# EAGLE design dualstepper (EAGLE 6.2)
LICENCE: Copyright Alan Wood 2011. This documentation describes Open Hardware and is licensed under the CERN OHL v. 1.1. You may redistribute and modify this documentation under the terms of the CERN OHL v.1.1. (http://ohwr.org/cernohl). This documentation is distributed WITHOUT ANY EXPRESS OR IMPLIED WARRANTY, INCLUDING OF MERCHANTABILITY, SATISFACTORY QUALITY AND FITNESS FOR A PARTICULAR PURPOSE. Please see the CERN OHL v.1.1 for applicable conditions
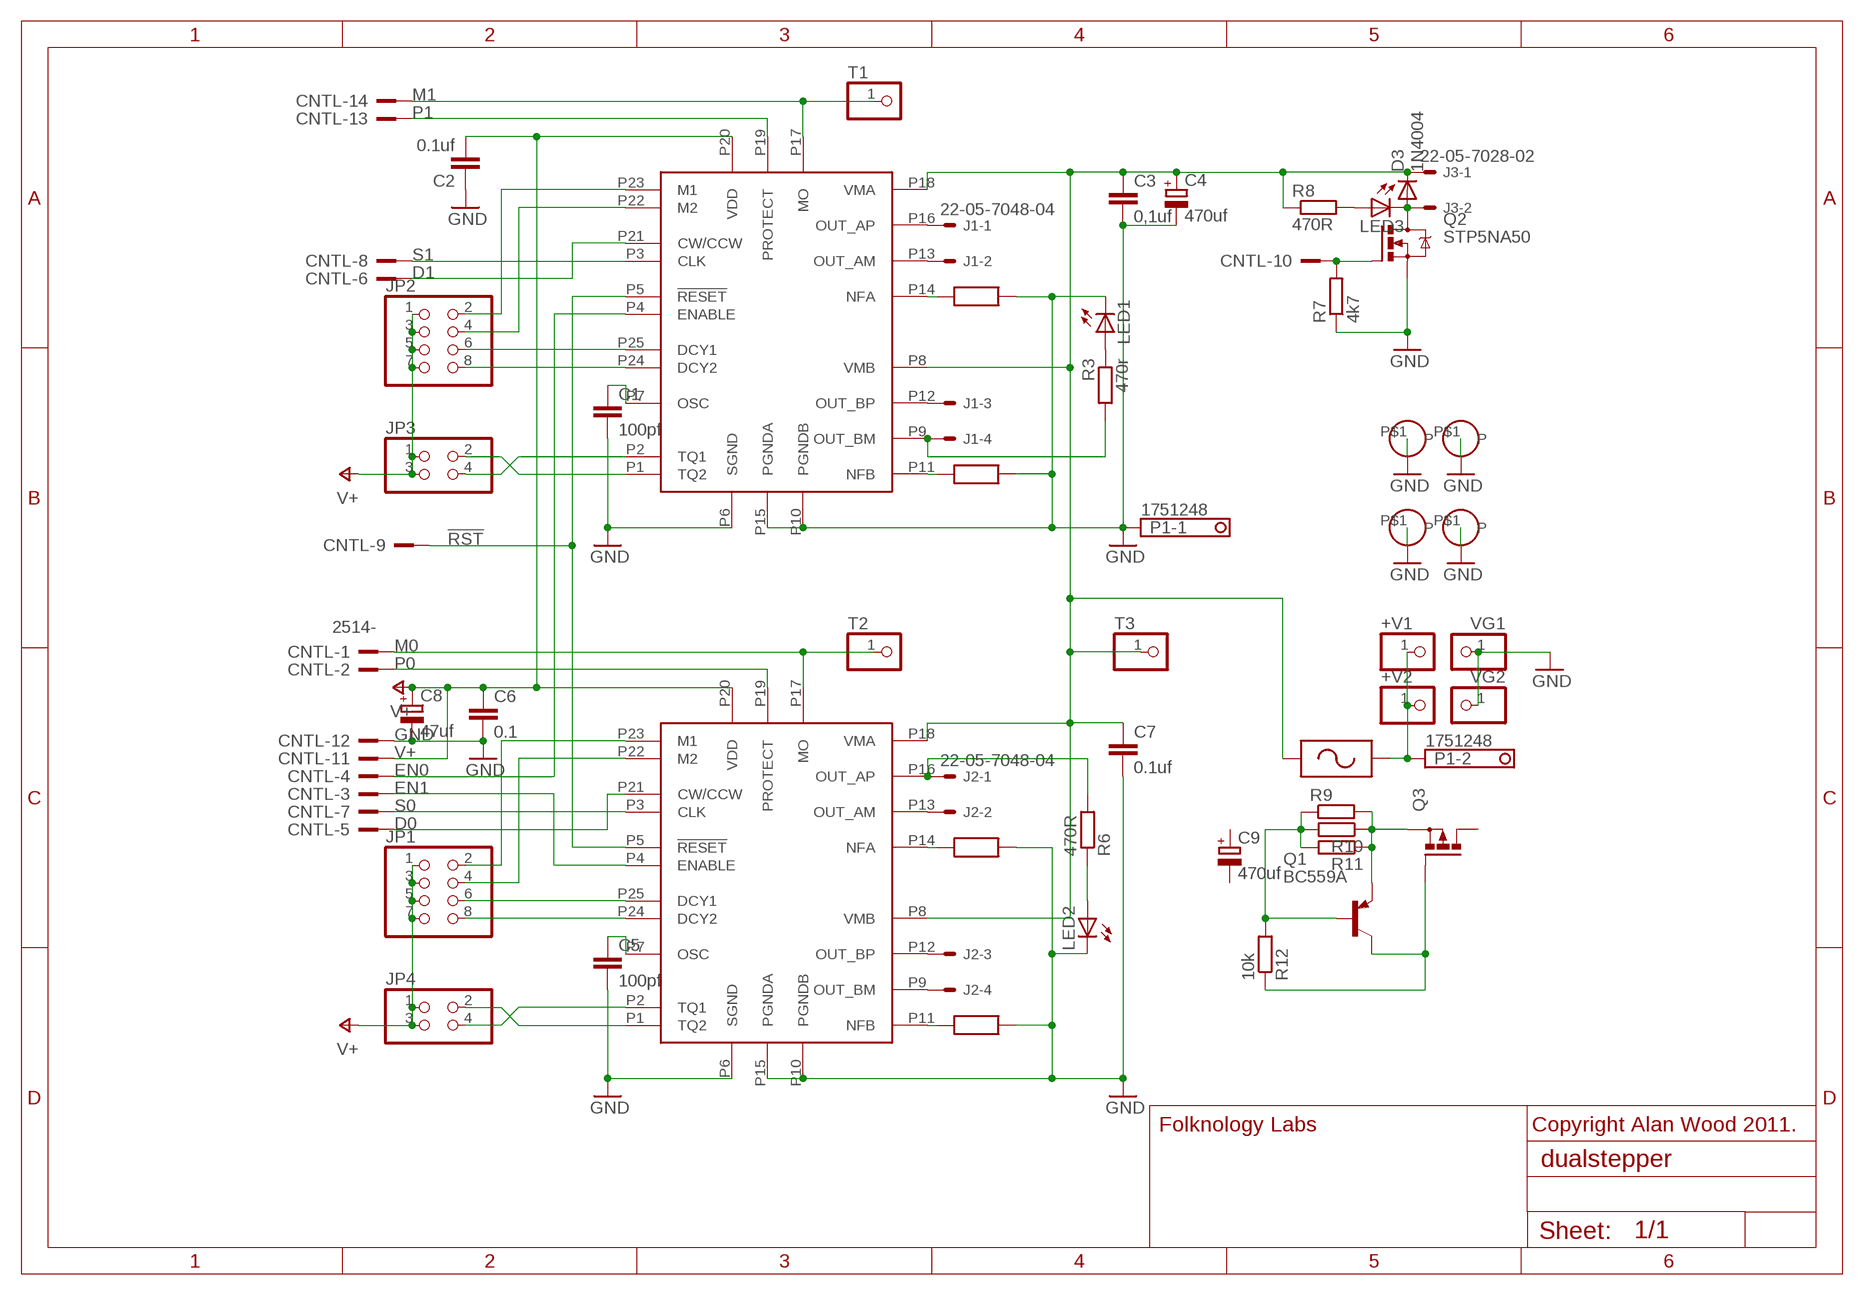
[diagram p0: schematic, sheet 1]

## Parts
+V1  PINHD-1X1  [1X01]
+V2  PINHD-1X1  [1X01]
C1  100pf  C-EU025-024X044  [C025-024X044]
C2  0.1uf  C-EU025-024X044  [C025-024X044]
C3  0,1uf  C-EU025-024X044  [C025-024X044]
C4  470uf  CPOL-EUE22-9AXIAL  [E22-9]
C5  100pf  C-EU025-024X044  [C025-024X044]
C6  0.1  C-EU025-024X044  [C025-024X044]
C7  0.1uf  C-EU025-024X044  [C025-024X044]
C8  47uf  CPOL-EUE1.8-4  [E1,8-4]
C9  470uf  CPOL-EUE3.5-8  [E3,5-8]
CNTL  2514-  [PAK100/2500-14]
D3  1N4004  DIODE-D-7.5  [D-7.5]
J1  22-05-7048-04  [7395-04]
J2  22-05-7048-04  [7395-04]
J3  22-05-7028-02  [7395-02]
JP1  PINHD-2X4  [2X04]
JP2  PINHD-2X4  [2X04]
JP3  PINHD-2X2  [2X02]
JP4  PINHD-2X2  [2X02]
LED1  LED3MM  [LED3MM]
LED2  LED3MM  [LED3MM]
LED3  LED3MM  [LED3MM]
P1  1751248  [1751248]
Q1  BC559A  [TO92-EBC]
Q2  STP5NA50  [TO220BV]
Q3  PMOSFET_PTO220BV  [TO220BV]
R1  R22  3W-WIREWOUND-RESISTOR  [R20]
R2  R22  3W-WIREWOUND-RESISTOR  [R20]
R3  470r  R-EU_0204/7  [0204/7]
R4  R22  3W-WIREWOUND-RESISTOR  [R20]
R5  R22  3W-WIREWOUND-RESISTOR  [R20]
R6  470R  R-EU_0204/7  [0204/7]
R7  4k7  R-EU_0204/7  [0204/7]
R8  470R  R-EU_0204/7  [0204/7]
R9  R-EU_0411/3V  [0411V]
R10  R-EU_0411/3V  [0411V]
R11  R-EU_0411/3V  [0411V]
R12  10k  R-EU_0204/7  [0204/7]
T1  PINHD-1X1  [1X01]
T2  PINHD-1X1  [1X01]
T3  PINHD-1X1  [1X01]
U$1  TB6560AHQ  [HZIP25-P-1.27]
U$2  TB6560AHQ  [HZIP25-P-1.27]
U$3  HOLE  [HOLE]
U$4  HOLE  [HOLE]
U$5  HOLE  [HOLE]
U$6  HOLE  [HOLE]
U$7  RXEFXXX-RAYCHEM-POLYSWITCH10.2  [2*10.2]
VG1  PINHD-1X1  [1X01]
VG2  PINHD-1X1  [1X01]

## Nets
!RST: CNTL.9 U$1.P5(!RESET) U$2.P5(!RESET)
D0: CNTL.5 U$1.P21(CW/CCW)
D1: CNTL.6 U$2.P21(CW/CCW)
EN0: CNTL.4 U$2.P4(ENABLE)
EN1: CNTL.3 U$1.P4(ENABLE)
GND: C1.2 C2.1 C3.2 C4.- C5.2 C6.2 C7.2 C8.- CNTL.12 LED1.K(C) LED2.K(C) P1.1 Q2.S R1.P$2 R2.P$2 R4.P$2 R5.P$2 R7.1 U$1.P6(SGND) U$1.P10(PGNDB) U$1.P15(PGNDA) U$2.P6(SGND) U$2.P10(PGNDB) U$2.P15(PGNDA) U$3.P$1(P) U$4.P$1(P) U$5.P$1(P) U$6.P$1(P) VG1.1 VG2.1
M0: CNTL.1 T2.1 U$1.P17(MO)
M1: CNTL.14 T1.1 U$2.P17(MO)
N$1: +V1.1 +V2.1 P1.2 U$7.P$2
N$2: J1.2 U$2.P13(OUT_AM)
N$3: J1.3 U$2.P12(OUT_BP)
N$4: J1.4 R3.2 U$2.P9(OUT_BM)
N$5: C1.1 U$2.P7(OSC)
N$6: JP2.2 U$2.P23(M1)
N$7: J2.2 U$1.P13(OUT_AM)
N$8: LED2.A R6.1
N$9: LED1.A R3.1
N$10: J2.3 U$1.P12(OUT_BP)
N$11: JP3.2 U$2.P1(TQ2)
N$12: JP3.4 U$2.P2(TQ1)
N$13: D3.A J3.2 LED3.K(C) Q2.D
N$14: J2.4 U$1.P9(OUT_BM)
N$15: J1.1 U$2.P16(OUT_AP)
N$16: Q1.B R9.1 R10.2 R11.2 R12.2
N$17: JP2.8 U$2.P24(DCY2)
N$18: JP2.6 U$2.P25(DCY1)
N$19: JP2.4 U$2.P22(M2)
N$20: Q1.E Q3.S R9.2 R10.1 R11.1
N$21: J2.1 R6.2 U$1.P16(OUT_AP)
N$22: Q1.C Q3.G R12.1
N$25: JP4.4 U$1.P2(TQ1)
N$26: JP4.2 U$1.P1(TQ2)
N$27: JP1.8 U$1.P24(DCY2)
N$29: JP1.6 U$1.P25(DCY1)
N$30: R2.P$1 U$2.P11(NFB)
N$31: JP1.4 U$1.P22(M2)
N$33: R1.P$1 U$2.P14(NFA)
N$34: R5.P$1 U$1.P11(NFB)
N$35: R4.P$1 U$1.P14(NFA)
N$36: C5.1 U$1.P7(OSC)
N$37: JP1.2 U$1.P23(M1)
N$50: CNTL.10 Q2.G R7.2
N$52: LED3.A R8.2
P0: CNTL.2 U$1.P19(PROTECT)
P1: CNTL.13 U$2.P19(PROTECT)
S0: CNTL.7 U$1.P3(CLK)
S1: CNTL.8 U$2.P3(CLK)
V+: C2.2 C6.1 C8.+ CNTL.11 JP1.1 JP1.3 JP1.5 JP1.7 JP2.1 JP2.3 JP2.5 JP2.7 JP3.1 JP3.3 JP4.1 JP4.3 U$1.P20(VDD) U$2.P20(VDD)
VM: C3.1 C4.+ C7.1 D3.C J3.1 R8.1 T3.1 U$1.P8(VMB) U$1.P18(VMA) U$2.P8(VMB) U$2.P18(VMA) U$7.P$1
Unconnected: C9.+ C9.- Q3.D

## Notes on the sheet
- Folknology Labs | Copyright Alan Wood 2011.

## Library data of the parts
+V1 +V2 T1-T3 VG1 VG2 = pinhead:PINHD-1X1: PIN HEADER; MF: MOLEX; MPN: 90120-0761; OC_FARNELL: 1756963
C1 C5 = resistor:C-EU: CAPACITOR, European symbol; MF: AVX; MPN: SR151A101JAR; OC_FARNELL: 1100372
C2 C3 C6 C7 = resistor:C-EU: CAPACITOR, European symbol; MF: VISHAY; MPN: K104K15X7RF53L2; OC_FARNELL: 1141775
C4 C9 = rcl:CPOL-EU: POLARIZED CAPACITOR, European symbol; MF: MULTICOMP; MPN: MCTEA471M1EB-1021P; OC_FARNELL: 1832427
C8 = rcl:CPOL-EU: POLARIZED CAPACITOR, European symbol; MF: RUBYCON; MPN: 16YXF47MEFC5X11; OC_FARNELL: 1144612
CNTL = con-3m:2514-: 3M (TM) Pak 100 4-Wall Header Source: 3M; MF: HARTING; MPN: 09 18 510 7323; OC_FARNELL: 1096980; OC_NEWARK: unknown
D3 = diode:DIODE-: DIODE; MF: ON SEMICONDUCTOR; MPN: 1N4004RL; OC_FARNELL: 9556109
J1 J2 = con-molex:22-?-04: CONNECTOR wire to board 2.54 mm (.1 inch) pitch header; MF: MOLEX; MPN: 22-05-7048; OC_FARNELL: 9731628; OC_NEWARK: unknown
J3 = con-molex:22-?-02: CONNECTOR wire to board 2.54 mm (.1 inch) pitch header; MF: MOLEX; MPN: 22-05-7028; OC_FARNELL: 9731601; OC_NEWARK: unknown
JP1 JP2 = pinhead:PINHD-2X4: PIN HEADER; MF: HARWIN; MPN: M20-9980446; OC_FARNELL: 1022233
JP3 JP4 = pinhead:PINHD-2X2: PIN HEADER; MF: SAMTEC; MPN: TSW-101-07-T-D; OC_FARNELL: 2025407
LED1-LED3 = led:LED: LED OSRAM: - CHIPLED LG R971, LG N971, LY N971, LG Q971, LY Q971, LO R971, LY R971 LH N974, LH R974 LS Q976, LO Q976, LY Q976 LO Q996 - Hyper CHIPLED LW Q18S LB Q993, LB Q99A, LB R99A - SideLED LS A670, LO A670, LY A670, LG A670, LP A670 LB A673, LV A673, LT A673, LW A673 LH A674 LY A675 LS A676, LA A676, LO A676, LY A676, LW A676 LS A679, LY A679, LG A679 - Hyper Micro SIDELED® LS Y876, LA Y876, LO Y876, LY Y876 LT Y87S - SmartLED LW L88C, LW L88S LB L89C, LB L89S, LG L890 LS L89K, LO L89K, LY L89K LS L896, LA L896, LO L896, LY L896 - TOPLED LS T670, LO T670, LY T670, LG T670, LP T670 LSG T670, LSP T670, LSY T670, LOP T670, LYG T670 LG T671, LOG T671, LSG T671 LB T673, LV T673, LT T673, LW T673 LH T674 LS T676, LA T676, LO T676, LY T676, LB T676, LH T676, LSB T676, LW T676 LB T67C, LV T67C, LT T67C, LS T67K, LO T67K, LY T67K, LW E67C LS E67B, LA E67B, LO E67B, LY E67B, LB E67C, LV E67C, LT E67C LW T67C LS T679, LY T679, LG T679 LS T770, LO T770, LY T770, LG T770, LP T770 LB T773, LV T773, LT T773, LW T773 LH T774 LS E675, LA E675, LY E675, LS T675 LS T776, LA T776, LO T776, LY T776, LB T776 LHGB T686 LT T68C, LB T68C - Hyper Mini TOPLED® LB M676 - Mini TOPLED Santana® LG M470 LS M47K, LO M47K, LY M47K Source: http://www.osram.convergy.de LUXEON: - LUMILED® LXK2-PW12-R00, LXK2-PW12-S00, LXK2-PW14-U00, LXK2-PW14-V00 LXK2-PM12-R00, LXK2-PM12-S00, LXK2-PM14-U00 LXK2-PE12-Q00, LXK2-PE12-R00, LXK2-PE12-S00, LXK2-PE14-T00, LXK2-PE14-U00 LXK2-PB12-K00, LXK2-PB12-L00, LXK2-PB12-M00, LXK2-PB14-N00, LXK2-PB14-P00, LXK2-PB14-Q00 LXK2-PR12-L00, LXK2-PR12-M00, LXK2-PR14-Q00, LXK2-PR14-R00 LXK2-PD12-Q00, LXK2-PD12-R00, LXK2-PD12-S00 LXK2-PH12-R00, LXK2-PH12-S00 LXK2-PL12-P00, LXK2-PL12-Q00, LXK2-PL12-R00 Source: www.luxeon.com KINGBRIGHT: KA-3528ASYC Source: www.kingbright.com; MF: KINGBRIGHT; MPN: L-93WEYW; OC_FARNELL: 1142521
P1 = con-phoenix-350:1751248: MKDS 1/ 2-3,5 Printklemme Nennstrom: 10 A Bemessungsspannung: 160 V Raster: 3,5 mm Polzahl: 2 Montageart: Löten Anschlussart: Schraubanschluss Anschlussrichtung vom Leiter zur Platine: 0° Source: http://eshop.phoenixcontact.com .. 1751248.pdf; MF: CAMDEN; MPN: CTB3051/2; OC_FARNELL: 3882615; OC_NEWARK: unknown
Q1 = transistor-pnp:BC559*: PNP Transistror
Q2 = transistor-power:STP5NA50: N-CHANNEL MOS FET; MF: STMICROELECTRONICS; MPN: STP55NF06L.; OC_FARNELL: 1783902
Q3 = transistor-power:PMOSFET_P: Power MOSFET P-Channel
R1 R2 R4 R5 = gen:3W-WIREWOUND-RESISTOR; MF: WELWYN; MPN: WP4S-R22JA2; OC_FARNELL: 1219242
R3 R6 R12 = rcl:R-EU_: RESISTOR, European symbol; MF: WELWYN; MPN: MFR4 470R 1%; OC_FARNELL: 1099883
R7 = resistor:R-EU_: RESISTOR, European symbol; MF: WELWYN; MPN: MFR4 10K 1%; OC_FARNELL: 1099988
R8 = resistor:R-EU_: RESISTOR, European symbol; MF: WELWYN; MPN: MFR4 470R 1%; OC_FARNELL: 1099883
R9-R11 = resistor:R-EU_: RESISTOR, European symbol
U$1 U$2 = gen:TB6560AHQ; OC_FARNELL: unknown
U$3-U$6 = amino:HOLE; OC_FARNELL: unknown
U$7 = gen:RXEFXXX-RAYCHEM-POLYSWITCH; MF: TE CONNECTIVITY / RAYCHEM; MPN: AGRF1000; OC_FARNELL: 1345899

## Board
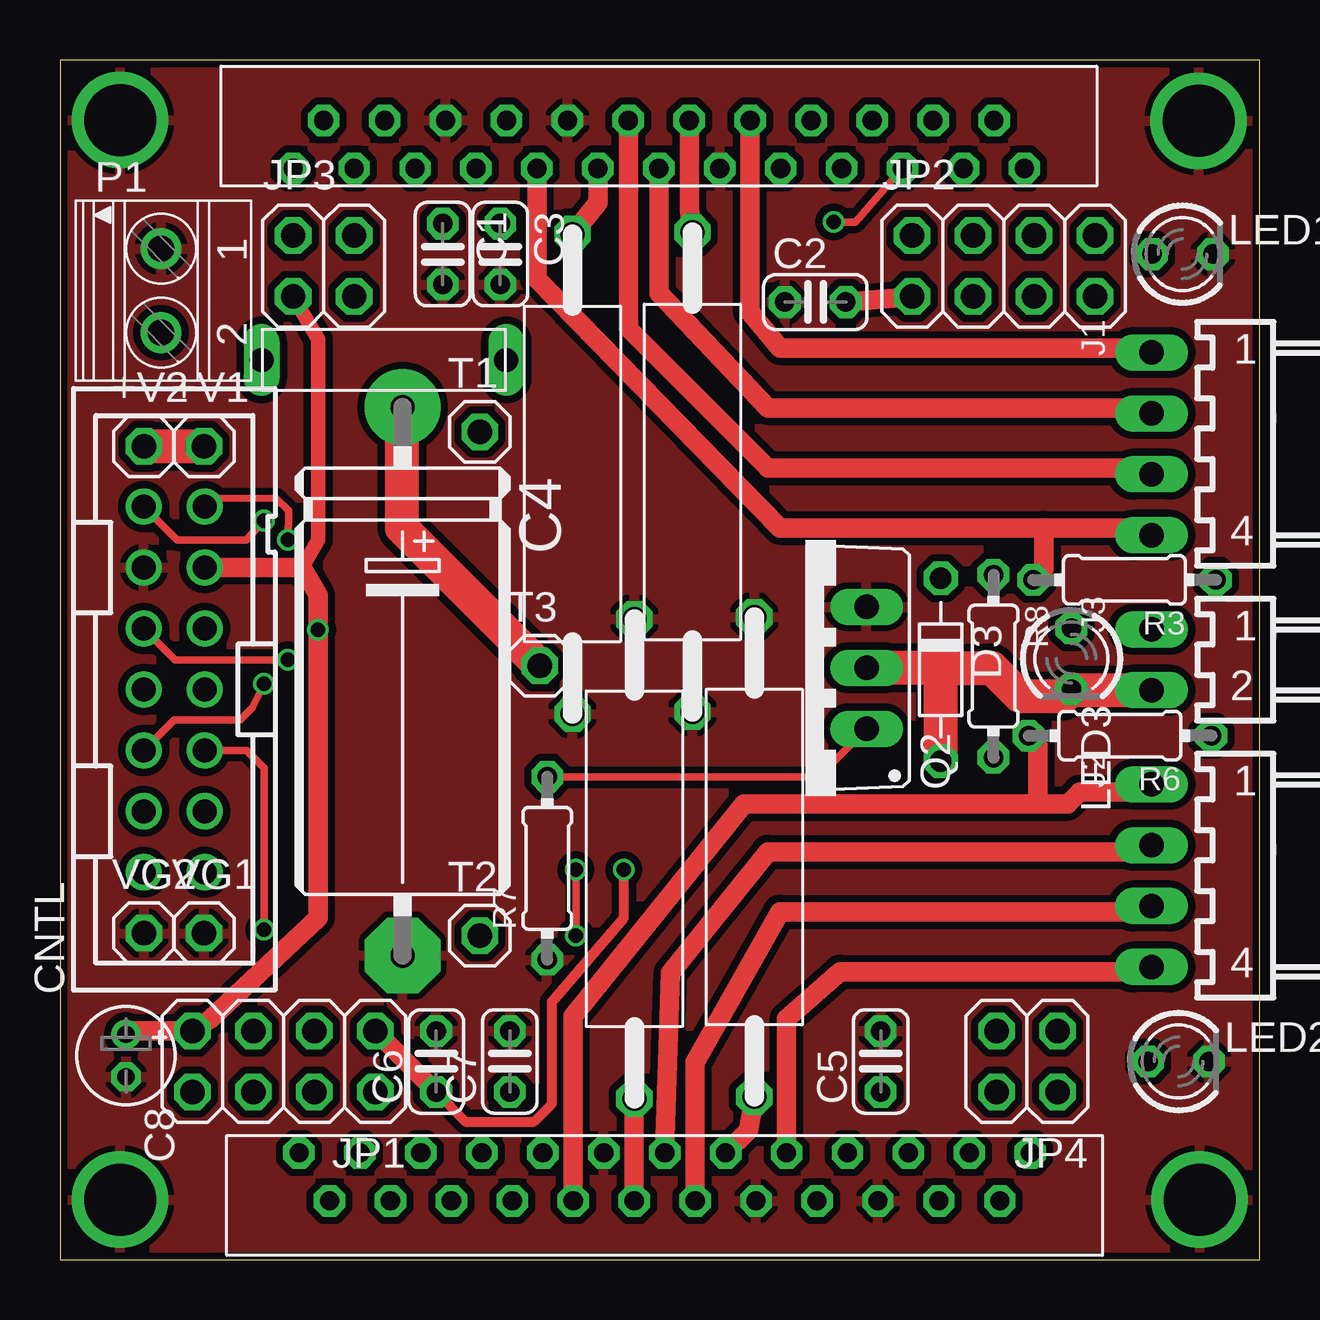
[diagram p1: board, top side]
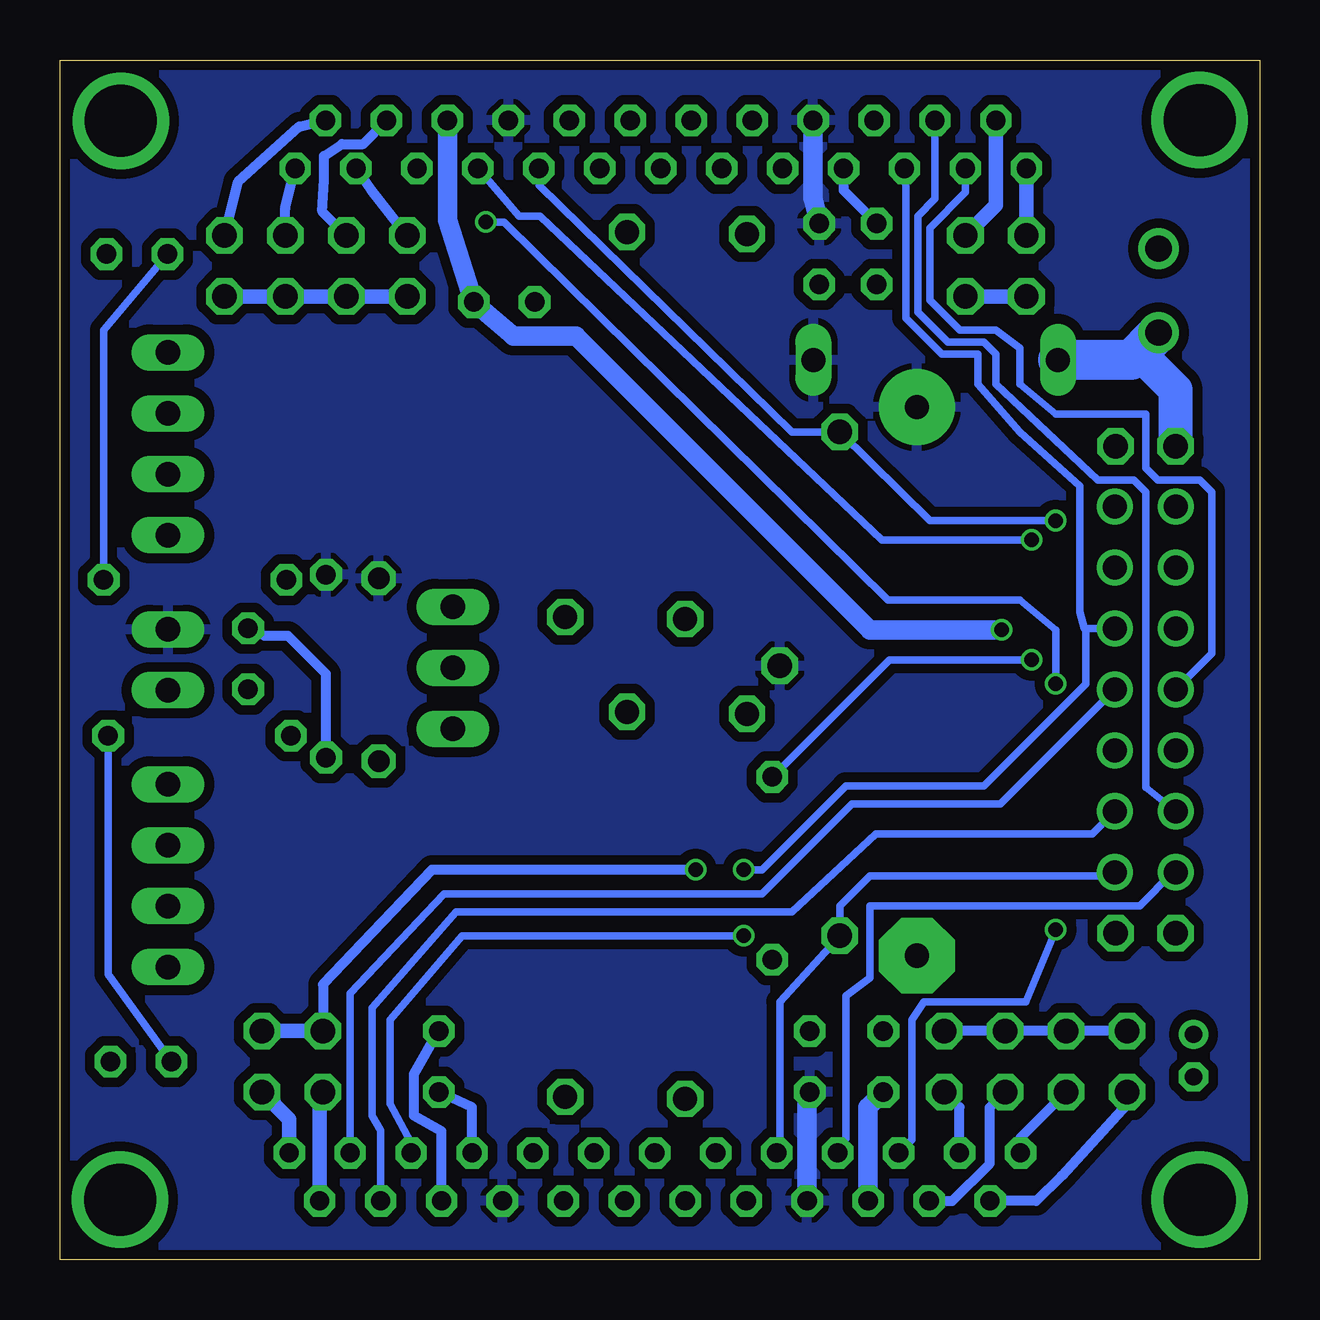
[diagram p2: board, bottom side, seen from below]

Size 50 x 50 mm. Coordinates in mm from the lower left corner, seen from the top.
Outline: 0,0 50,0 50,50 0,50 0,0
Copper layers (1*16): Top 0.035mm / dielectric 1.5mm / Bottom 0.035mm
Design rules: minimum track width 6mil, minimum drill 12mil, track to track 6mil, track to pad 6mil, pad to pad 6mil, via to via 6mil, smd to smd 0mil, copper to edge 10mil, drill to drill 10mil, minimum pad ring 10mil, minimum via ring 6mil, stop-mask expansion 2mil, vias tented up to drill 100mil, thermal gap 10mil

### Footprints (pad centres in the part's own frame; a part is rotated, then mirrored left to right if it is on the bottom)
1X01 = drill 1.016 octagon: 1 0,0
C025-024X044 = drill 0.813 octagon: 1 -1.27,0; 2 1.27,0
E22-9 = drill 1.016 pad 3.15: + -11.43,0 | drill 1.016 pad 3.15 octagon: - 11.43,0
E1,8-4 = drill 0.711 pad 1.168: + -0.889,0 | drill 0.711 pad 1.168 octagon: - 0.889,0
E3,5-8 = drill 0.813 pad 1.6: + -1.778,0 | drill 0.813 pad 1.6 octagon: - 1.778,0
PAK100/2500-14 = drill 1 pad 1.422: 1 -7.62,-1.27; 2 -7.62,1.27; 3 -5.08,-1.27; 4 -5.08,1.27; 5 -2.54,-1.27; 6 -2.54,1.27; 7 0,-1.27; 8 0,1.27; 9 2.54,-1.27; 10 2.54,1.27; 11 5.08,-1.27; 12 5.08,1.27; 13 7.62,-1.27; 14 7.62,1.27
D-7.5 = drill 0.9 octagon: A 3.81,0; C -3.81,0
7395-04 = drill 1.016 long: 1 3.81,0; 2 1.27,0; 3 -1.27,0; 4 -3.81,0
7395-02 = drill 1.016 long: 1 1.27,0; 2 -1.27,0
2X04 = drill 1.016 octagon: 1 -3.81,-1.27; 2 -3.81,1.27; 3 -1.27,-1.27; 4 -1.27,1.27; 5 1.27,-1.27; 6 1.27,1.27; 7 3.81,-1.27; 8 3.81,1.27
2X02 = drill 1.016 octagon: 1 -1.27,-1.27; 2 -1.27,1.27; 3 1.27,-1.27; 4 1.27,1.27
LED3MM = drill 0.813 octagon: A -1.27,0; K 1.27,0
1751248 = drill 1.1 pad 1.7: 1 -1.75,-0.1; 2 1.75,-0.1
TO92-EBC = drill 0.813 long: B 0,-1.27; C -2.54,-1.27; E 2.54,-1.27
TO220BV = drill 1.016 long: D 0,-2.54; G -2.54,-2.54; S 2.54,-2.54
R20 = drill 1 octagon: P$1 -10,0; P$2 10,0
0204/7 = drill 0.813 octagon: 1 -3.81,0; 2 3.81,0
0411V = drill 0.914 octagon: 1 -2.54,0; 2 1.27,0
HZIP25-P-1.27 = drill 0.8 octagon: P1 -15.24,-1.27; P2 -13.97,0.73; P3 -12.7,-1.27; P4 -11.43,0.73; P5 -10.16,-1.27; P6 -8.89,0.73; P7 -7.62,-1.27; P8 -6.35,0.73; P9 -5.08,-1.27; P10 -3.81,0.73; P11 -2.54,-1.27; P12 -1.27,0.73; P13 0,-1.27; P14 1.27,0.73; P15 2.54,-1.27; P16 3.81,0.73; P17 5.08,-1.27; P18 6.35,0.73; P19 7.62,-1.27; P20 8.89,0.73; P21 10.16,-1.27; P22 11.43,0.73; P23 12.7,-1.27; P24 13.97,0.73; P25 15.24,-1.27
HOLE = drill 3: P$1 0,0
2*10.2 = drill 1 long: P$1 -5.1,0; P$2 5.1,0

### Placement (x,y rotation side)
+V1  6,33.9 0 top
+V2  3.5,33.9 0 top
C1  15.96,41.91 270 top
C2  31.48,39.91 0 top
C3  18.35,41.91 270 top
C4  14.28,24.1 270 top
C5  34.21,8.26 90 top
C6  15.68,8.26 90 top
C7  18.75,8.26 90 top
C8  2.75,8.5 270 top
C9  69.25,24.5 180 top  (outside the outline)
CNTL  4.76,23.77 90 top
D3  36.72,24.59 270 top
J1  45.5,34 90 top
J2  45.5,16 90 top
J3  45.5,25 90 top
JP1  9.33,8.26 180 top
JP2  39.34,41.41 0 top
JP3  10.99,41.41 0 top
JP4  40.31,8.26 180 top
LED1  46.79,41.91 0 top
LED2  46.62,8.26 0 top
LED3  42.16,25.05 270 top
P1  4.31,40.38 270 top
Q1  67.5,35.5 180 top  (outside the outline)
Q2  31.08,24.66 90 top
Q3  69,29.25 180 top  (outside the outline)
R1  26.36,32.83 270 top
R2  21.36,32.75 270 top
R3  44.37,28.33 180 top
R4  23.94,16.7 90 top
R5  28.94,16.78 90 top
R6  44.18,21.84 180 top
R7  20.31,16.3 90 top
R8  38.91,24.73 270 top
R9  66.5,43.5 180 top  (outside the outline)
R10  68.5,46.25 0 top  (outside the outline)
R11  68.5,40.5 0 top  (outside the outline)
R12  72.5,43.25 90 top  (outside the outline)
T1  17.5,34.5 0 top
T2  17.5,13.5 0 top
T3  20,24.75 0 top
U$1  25.2,3.17 180 top
U$2  24.96,46.75 0 top
U$3  2.5,47.5 0 top
U$4  2.5,2.5 0 top
U$5  47.5,2.5 0 top
U$6  47.46,47.46 0 top
U$7  13.5,37.5 180 top
VG1  6,13.6 0 top
VG2  3.5,13.6 0 top

### Tracks (layer width: path | path; a pad name or v marks a point on that pad's centre or on a via)
!RST  (via drill 0.6)
  Top 0.305: v21.5,16.25 v21.5,13.5
  Bottom 0.305: U$2.P5 14.75,44.67 14.75,39.25 13.25,37.75 11.75,37.75 11.75,36.5 10,34.5 7.5,32.25 7.5,27 7.3,26.3 7.25,26.3 | 7.25,26.3 CNTL.9 | U$1.P5 35.37,4.87 36.25,6.5 36.25,10 33.25,13.5 v21.5,13.5 | v21.5,16.25 20.75,16.25 17.25,19.75 11.5,19.75 7.25,24 7.25,26.3
D0  (via drill 0.6)
  Top 0.305: v8.5,13.75 8.5,20.5 7.78,21.23 CNTL.5
  Bottom 0.305: U$1.P21 14.5,4.99 14.5,10 14,10.75 9.75,10.75 v8.5,13.75
D1  (via drill 0.6)
  Top 0.305: U$2.P21 33.15,43.25 v32.25,43.25 | v8.5,24 8,23 7.5,22.5 4.77,22.5 CNTL.6
  Bottom 0.305: v32.25,43.25 31.5,43.25 15.5,27.5 10,27.5 8.5,26.25 v8.5,24
EN0
  Bottom 0.305: U$2.P4 13.53,44.22 14.25,43.5 14.25,39.5 13,38.25 11.5,38.25 11,37.75 11,36.5 6.75,32.5 5.25,32.5 4.75,32 4.75,19.68 CNTL.4
EN1
  Bottom 0.305: U$1.P4 36.63,5.38 37,6 37,10.5 33.5,14.5 19.5,14.5 16,17.75 6.97,17.75 CNTL.3
GND
  Bottom 0.406: C5.2 35.25,7.74 35.25,6 34.09,5.34 U$1.P6
  pour Top (isolate 0.305): 0,50 50,50 50,0 0,0
M0
  Bottom 0.305: U$1.P17 20,4.57 20,10.75 T2.1 17.5,14.75 16.25,16 6.18,16 CNTL.1
M1  (via drill 0.6)
  Top 0.305: v8.5,30.8 7.75,30 4.88,30 CNTL.14
  Bottom 0.305: U$2.P17 30.04,44.79 19.5,34.5 T1.1 13.75,30.8 v8.5,30.8
N$1
  Top 1.422: +V2.1 +V1.1
  Bottom 1.422: 5.34,37.5 4.75,37.5 3.5,36.25 +V2.1
  Bottom 1.676: P1.2 5.34,37.5 U$7.P$2
N$2
  Top 0.813: U$2.P13 24.96,40.29 29.5,35.5 45.27,35.5 J1.2
N$3
  Top 0.813: U$2.P12 23.69,38.81 29.5,33 45.23,33 J1.3
N$4
  Top 0.813: U$2.P9 19.88,40.87 30,30.5 41,30.5 | 41,30.5 45.19,30.5 J1.4 | R3.2 41,28.77 41,30.5
N$5
  Bottom 0.406: U$2.P7 17.34,44.56 C1.1
N$6
  Bottom 0.406: U$2.P23 37.02,44.59 JP2.2
N$7
  Top 0.813: U$1.P13 25.45,11.96 29.5,17 45.23,17 J2.2
N$8
  Bottom 0.305: R6.1 47.99,11.89 LED2.A
N$9
  Bottom 0.305: R3.1 48.18,38.75 LED1.A
N$10
  Top 0.813: U$1.P12 26.48,8.22 30,14.5 45.27,14.5 J2.3
N$11
  Bottom 0.61: JP3.2 U$2.P1
N$12
  Bottom 0.61: U$2.P2 10.99,43.95 JP3.4
N$13
  Top 1.422: 36.5,24.66 Q2.D | 36.5,24.66 38.84,24.66 40,23.5 41.88,23.5 LED3.K 42.2,23.73 J3.2 | D3.A 36.72,24.45 36.5,24.66
N$14
  Top 0.813: U$1.P9 30.29,10.04 32.5,12 45.31,12 J2.4
N$15
  Top 0.813: U$2.P16 28.77,39.48 30,38 45.31,38 J1.1
N$16  (4 unrouted)
N$17
  Bottom 0.406: U$2.P24 40.03,47.22 42.57,44.93 JP2.8
N$18
  Bottom 0.406: U$2.P25 40.6,43.81 JP2.6
N$19
  Bottom 0.406: U$2.P22 37.36,46.5 38.25,46.5 39,46 39,45 39.06,43.69 JP2.4
N$20  (4 unrouted)
N$21
  Top 0.813: U$1.P16 21.39,10.14 28.5,19 40.75,19 | 40.75,19 42,19 42.5,19.5 45.19,19.5 J2.1 | R6.2 40.75,21.45 40.75,19
N$22  (2 unrouted)
N$25
  Bottom 0.61: U$1.P2 39.17,6.85 JP4.4
N$26
  Bottom 0.61: U$1.P1 40.45,5.85 JP4.2
N$27
  Bottom 0.406: U$1.P24 9.3,2.44 8.25,3.5 5.5,6.5 JP1.8
N$29
  Bottom 0.406: U$1.P25 9.96,5.08 JP1.6
N$30
  Top 0.813: U$2.P11 22.42,44.06 R2.P$1
N$31
  Bottom 0.406: U$1.P22 12.8,2.44 11.25,4 11.25,6.33 JP1.4
N$33
  Top 0.813: U$2.P14 26.23,43.71 R1.P$1
N$34
  Top 0.813: U$1.P11 28.69,5.39 R5.P$1
N$35
  Top 0.813: U$1.P14 23.93,6.46 R4.P$1
N$36
  Bottom 0.406: U$1.P7 32.83,6.35 C5.1
N$37
  Bottom 0.406: U$1.P23 12.51,6.35 JP1.2
N$50  (via drill 0.6)
  Top 0.305: Q2.G 31.61,20.11 R7.2 | v9.5,25 4.8,25 CNTL.10
  Bottom 0.305: R7.2 15.43,25 v9.5,25
N$52
  Bottom 0.406: R8.2 38.91,24.41 40.5,26 41.48,26 LED3.A
P0
  Bottom 0.305: U$1.P19 17.25,5.03 17.25,11 16.25,11.75 16.25,14.75 5,14.75 3.6,16.14 CNTL.2
P1  (via drill 0.6)
  Top 0.305: v9.5,30 9.54,31.21 9,31.71 6.5,31.75 CNTL.13
  Bottom 0.305: U$2.P19 30.86,43.5 30,43.5 15.75,30 v9.5,30
S0
  Bottom 0.305: U$1.P3 37.91,11.1 34,15.25 20.75,15.25 17,19 10.8,19 CNTL.7
S1
  Bottom 0.305: U$2.P3 12.26,44.49 13.75,43 13.75,40 12.5,38.75 11,38.75 10,38 10,36.5 8.5,35.25 4.75,35.25 4.75,33.25 4.75,33 4.25,32.5 2.5,32.5 2,32 2,25.26 CNTL.8
V+  (via drill 0.6)
  Top 0.406: v23.5,16.25 23.5,14.25 20.5,10.75 20.5,6.5 19.75,5.75 16.91,5.75 C6.1
  Top 0.61: JP3.1 10.75,38.36 10.75,30 10.1,28.84
  Top 0.813: JP1.1 C6.1 | C2.2 JP2.1 | CNTL.11 10.1,28.84 10.75,27.69 v10.75,26.25 10.75,14.25 6.28,10.03 JP1.7 2.89,9.53 C8.+
  Bottom 0.406: JP1.7 JP1.5 JP1.3 JP1.1 | JP4.3 39.04,11.46 34.5,16.25 v23.5,16.25
  Bottom 0.61: JP4.3 JP4.1 | JP2.7 JP2.5 JP2.3 JP2.1 | JP3.1 JP3.3
  Bottom 0.813: U$1.P20 16.32,6.35 C6.1 | U$2.P20 33.85,43.31 C2.2 31.09,38.5 28.5,38.5 16.25,26.25 v10.75,26.25
VM
  Top 1.422: T3.1 14.25,30.5 14.25,35.5
  Bottom 0.813: U$2.P8 18.61,44.23 C3.1 | U$1.P18 18.86,6.88 C7.1
  pour Bottom (isolate 0.406): 0,50 50,50 50,0 0,0

### Text on the board
Document: GND | GND | C2 | C1 | C3 | LD1 | + | µstep decay | 1 0 | 2 25 | 16 50 | 8 100 | R2 | R1 | R3 | C4 | + | R8 | DSM V1 | Folknology | Labs | R6 | Copyright | R4 | R5 | Alan Wood | Torque | 100 | 2011 | R7 | 75 | 50 | 20 | C6 | + | C7 | C5 | LD2 | C8 | GND | GND
Reference: #44419